# EAGLE design dherosh (EAGLE 9.2.2)
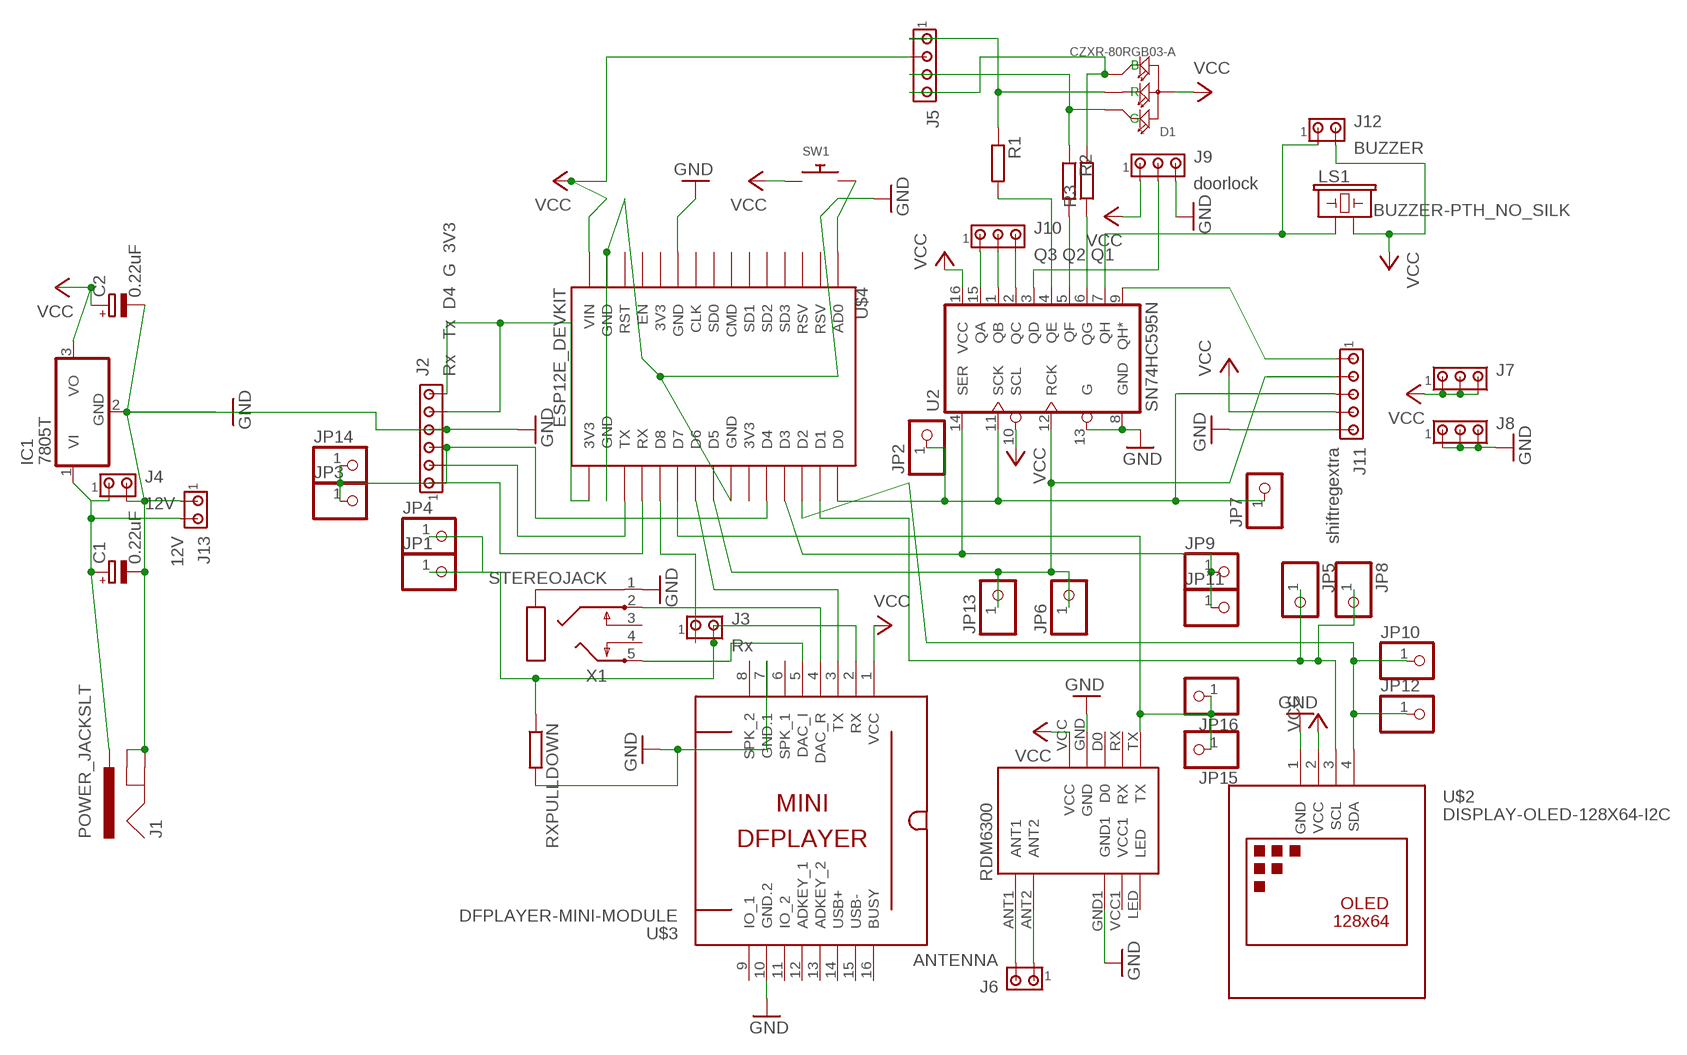
[diagram p0: schematic, sheet 1]

## Parts
C1  0.22uF  CPOL-EUE2-5  [E2-5]
C2  0.22uF  CPOL-EUE2-5  [E2-5]
D1  CZXR-80RGB03-A  DIP-LED-RGB-COMMON-ANODE(4P-D8MM)  [LED4-2.0-D8.0MM]
IC1  7805T  [TO220H]
J1  POWER_JACKSLT  [POWER_JACK_SLOT]
J2  Rx Tx D4 G 3V3  MTA06-100  [10X06MTA]
J3  Rx  MTA02-100  [10X02MTA]
J4  12V  MTA02-100  [10X02MTA]
J5  MTA04-100  [10X04MTA]
J6  ANTENNA  MTA02-100  [10X02MTA]
J7  MTA03-100  [10X03MTA]
J8  MTA03-100  [10X03MTA]
J9  doorlock  MTA03-100  [10X03MTA]
J10  Q3 Q2 Q1  MTA03-100  [10X03MTA]
J11  shiftregextra  MTA05-100  [10X05MTA]
J12  BUZZER  MTA02-100  [10X02MTA]
J13  12V  MTA02-100  [10X02MTA]
JP1  PINHD-1X1  [1X01]
JP2  PINHD-1X1  [1X01]
JP3  PINHD-1X1  [1X01]
JP4  PINHD-1X1  [1X01]
JP5  PINHD-1X1  [1X01]
JP6  PINHD-1X1  [1X01]
JP7  PINHD-1X1  [1X01]
JP8  PINHD-1X1  [1X01]
JP9  PINHD-1X1  [1X01]
JP10  PINHD-1X1  [1X01]
JP11  PINHD-1X1  [1X01]
JP12  PINHD-1X1  [1X01]
JP13  PINHD-1X1  [1X01]
JP14  PINHD-1X1  [1X01]
JP15  PINHD-1X1  [1X01]
JP16  PINHD-1X1  [1X01]
LS1  BUZZER-PTH_NO_SILK  [BUZZER-12MM-NS]
R1  R-EU_0204/7  [0204/7]
R2  R-EU_0204/7  [0204/7]
R3  R-EU_0204/7  [0204/7]
RDM1  RDM6300  [RDM6300]
RXPULLDOWN  R-EU_0204/7  [0204/7]
SW1  SWITCH_PUSHBUTTONEVQ-PE  [TACT_PANA-EVQ]
U2  SN74HC595N  74HC595N  [DIP16]
U$2  DISPLAY-OLED-128X64-I2C  [DISPLAY-OLED-128X64-I2C]
U$3  DFPLAYER-MINI-MODULE  [DFPLAYER-MINI-MODULE]
U$4  ESP12E_DEVKIT  [ESP12E_DEVKIT]
X1  STEREOJACK  [STX3100]

## Nets
GND: C1.- C2.- IC1.2(GND) J1.GND@1(GNDBREAK) J1.GND@2(GND) J2.4 J4.2 J8.1 J8.2 J8.3 J9.3 J11.5 J13.1 RDM1.GND RDM1.GND1 RXPULLDOWN.2 U2.8(GND) U2.13(G) U$2.1(GND) U$3.7(GND.1) U$3.10(GND.2) U$4.GND@0(GND) U$4.GND@1(GND) U$4.GND@2(GND) U$4.GND@3(GND) X1.1
N$1: C1.+ IC1.1(VI) J1.PWR J4.1 J13.2
N$2: J2.5 J2.6 U$4.3V3@2(3V3)
N$3: U$3.3(TX) U$4.D6
N$4: J2.3 JP3.1 JP14.1 U$4.D4
N$5: U$3.5(DAC_I) X1.5
N$6: U$3.4(DAC_R) X1.2
N$7: J11.3 JP2.1 JP7.1 U2.11(SCK) U$4.D0
N$8: J11.2 JP6.1 JP13.1 U2.12(RCK) U$4.D5
N$9: J3.2 JP1.1 JP4.1 RXPULLDOWN.1 U$3.2(RX)
N$10: JP15.1 JP16.1 RDM1.TX U$4.D7
N$11: JP5.1 JP8.1 U$2.3(SCL) U$4.D1
N$12: JP10.1 JP12.1 U$2.4(SDA) U$4.D2
N$13: J10.1 U2.15(QA)
N$14: D1.4(B) J5.4 R3.2
N$15: R3.1 U2.6(QG)
N$16: D1.1(R) J5.1 R1.1
N$17: R2.2 U2.5(QF)
N$19: SW1.P$2 U$4.AD0
N$20: J11.1 U2.9(QH*)
N$21: J12.1 LS1.+ U2.7(QH)
N$22: J10.2 U2.1(QB)
N$23: J10.3 U2.2(QC)
N$24: J2.1 U$4.RX
N$25: J9.2 U2.3(QD)
N$26: R1.2 U2.4(QE)
N$27: J2.2 U$4.TX
N$29: J6.2 RDM1.ANT1
N$30: J6.1 RDM1.ANT2
N$31: J3.1 U$4.D8
N$32: JP9.1 JP11.1 U2.14(SER) U$4.D3
N$34: D1.3(G) J5.3 R2.1
VCC: C2.+ D1.2(+) IC1.3(VO) J5.2 J7.1 J7.2 J7.3 J9.1 J11.4 J12.2 LS1.- RDM1.VCC SW1.P$1 U2.10(SCL) U2.16(VCC) U$2.2(VCC) U$3.1(VCC) U$4.VIN
Unconnected: RDM1.D0 RDM1.LED RDM1.RX RDM1.VCC1 U$3.6(SPK_1) U$3.8(SPK_2) U$3.9(IO_1) U$3.11(IO_2) U$3.12(ADKEY_1) U$3.13(ADKEY_2) U$3.14(USB+) U$3.15(USB-) U$3.16(BUSY) U$4.3V3@0(3V3) U$4.3V3@1(3V3) U$4.CLK U$4.CMD U$4.EN U$4.RST U$4.RSV@0(RSV) U$4.RSV@1(RSV) U$4.SD0 U$4.SD1 U$4.SD2 U$4.SD3 X1.3 X1.4

## Library data of the parts
C1 C2 = rcl:CPOL-EU: POLARIZED CAPACITOR, European symbol; SPICEPREFIX: C
D1 = OPL_Optoelectronics:DIP-LED-RGB-COMMON-ANODE(4P-D8MM): 304090065; MPN: CZXR-80RGB03-A
IC1 = adafruit:78*: Positive VOLTAGE REGULATOR Added bigger pads to the TO-92 package
J1 = SparkFun-Connectors:POWER_JACK: Power Jack Connector This is the standard 5.5mm barrel jack for power. The PTH is the most common, proven, reliable, footprint. The Slot footprint only works if the mill layer is transmitted to the PCB fab house so be warned. Here are the connectors we sell at SparkFun: DC Barrel Power Jack/Connector <https://www.sparkfun.com/products/119> (PRT-00119) DC Barrel Power Jack/Connector (SMD) <https://www.sparkfun.com/products/12748> (PRT-12748) DC Barrel Jack Adapter - Breadboard Compatible <https://www.sparkfun.com/products/10811> (PRT-10811) It is used on this SparkFun product (and many, many others): SparkFun RedBoard - Programmed with Arduino <https://www.sparkfun.com/products/12757> (DEV-12757) Also, if you need a mating power supply or connector, please check these out: Wall Adapter Power Supply - 9VDC 650mA <https://www.sparkfun.com/products/298> (TOL-00298) DC Barrel Jack Adapter - Male <https://www.sparkfun.com/products/10287> (PRT-10287); PROD_ID: PRT-00119
J2 = con-amp:MTA06-100: AMP connector Connection corrected 2014-09-19
J3 J4 J6 J12 J13 = con-amp:MTA02-100: AMP connector
J5 = con-amp:MTA04-100: AMP connector
J7-J10 = con-amp:MTA03-100: AMP connector
J11 = con-amp:MTA05-100: AMP connector
JP1-JP16 = pinhead:PINHD-1X1: PIN HEADER
LS1 = SparkFun-Electromechanical:BUZZER: Buzzer Small round buzzers that operate around the audible 2kHz range. You can use these as speakers to create simple music or user interfaces. Variant Overview: PTH - Mini Speaker - PC Mount 12mm 2.048kHz <https://www.sparkfun.com/products/7950> PTH_KIT - Mini Speaker - PC Mount 12mm 2.048kHz <https://www.sparkfun.com/products/7950> KIT simplifies soldering by adding stop mask to one side of the pads. PTH_NO_SILK - Mini Speaker - PC Mount 12mm 2.048kHz <https://www.sparkfun.com/products/7950> No silkscreen indicator of buzzer outline. PTH_KIT_NO_SILK - Mini Speaker - PC Mount 12mm 2.048kHz <https://www.sparkfun.com/products/7950> KIT package w/o silkscreen SMD - Buzzer Audio Magnetic (CCV-084B16) SMD buzzer used on, e.g. the LilyPad Buzzer <https://www.sparkfun.com/products/8463> and RFID USB Reader <https://www.sparkfun.com/products/9963>. SMD_KIT - Buzzer Audio Magnetic (CCV-084B16) SMD Buzzer with elongated pins to make soldering easier. Used on the SparkFun Simon Says - Surface Mount Soldering Kit <https://www.sparkfun.com/products/10935>.; PROD_ID: COMP-08253; SF_SKU: COM-07950
R1-R3 RXPULLDOWN = rcl:R-EU_: RESISTOR, European symbol; SPICEPREFIX: R
RDM1 = rdm6300:RDM6300: 125kHz RFID Reader Module
SW1 = adafruit:SWITCH_PUSHBUTTON: Buttons SOFTTOUCHSMD_SJ - Soft touch temporary push button (Super Junk Akihabara) Compatible with SKPMANE010 [Mouser: 688-SKPMAN] C&K_KSS = Digikey: KSS221GLFS
U2 = SparkFun-IC-Logic:74*595: 8-Bit Shift Register (Serial to Parallel) Datasheet <http://cdn.sparkfun.com/datasheets/BreakoutBoards/MM74HC595.pdf> SparkFun Products SparkFun Shift Register Breakout - 74HC595 <https://www.sparkfun.com/products/10680> (BOB-10680); PROD_ID: IC-13123
U$2 = diy-modules:DISPLAY-OLED-128X64-I2C: 128x64 Dot Matrix OLED Module based on SSD1306 chip Variant with I2C interface More details available here: http://www.instructables.com/id/Monochrome-096-i2c-OLED-display-with-arduino-SSD13/ SSD1306 datasheet: https://cdn-shop.adafruit.com/datasheets/SSD1306.pdf Click here to find device on ebay.com <http://www.ebay.com/sch/oled+display+128x64+iic> Note: There are two variants: I2C and SPI. Search for the proper version.
U$3 = diy-modules:DFPLAYER-MINI-MODULE: DFPlayer Mini - MP3 player module based on YX5200 chip More details available here: https://www.dfrobot.com/wiki/index.php/DFPlayer_Mini_SKU:DFR0299 Click here to find device on ebay.com <http://www.ebay.com/sch/dfplayer+mini>
U$4 = ESP12E_DEVKIT:ESP12E_DEVKIT: ESP12E DEVKIT BOARD
X1 = adafruit:STEREOJACK: MIC/HEADPHONE JACK Stereo jack with two switches. Kycon STX3100, CUI SJ1-3555NG and/or 4UCon 05544

## Board
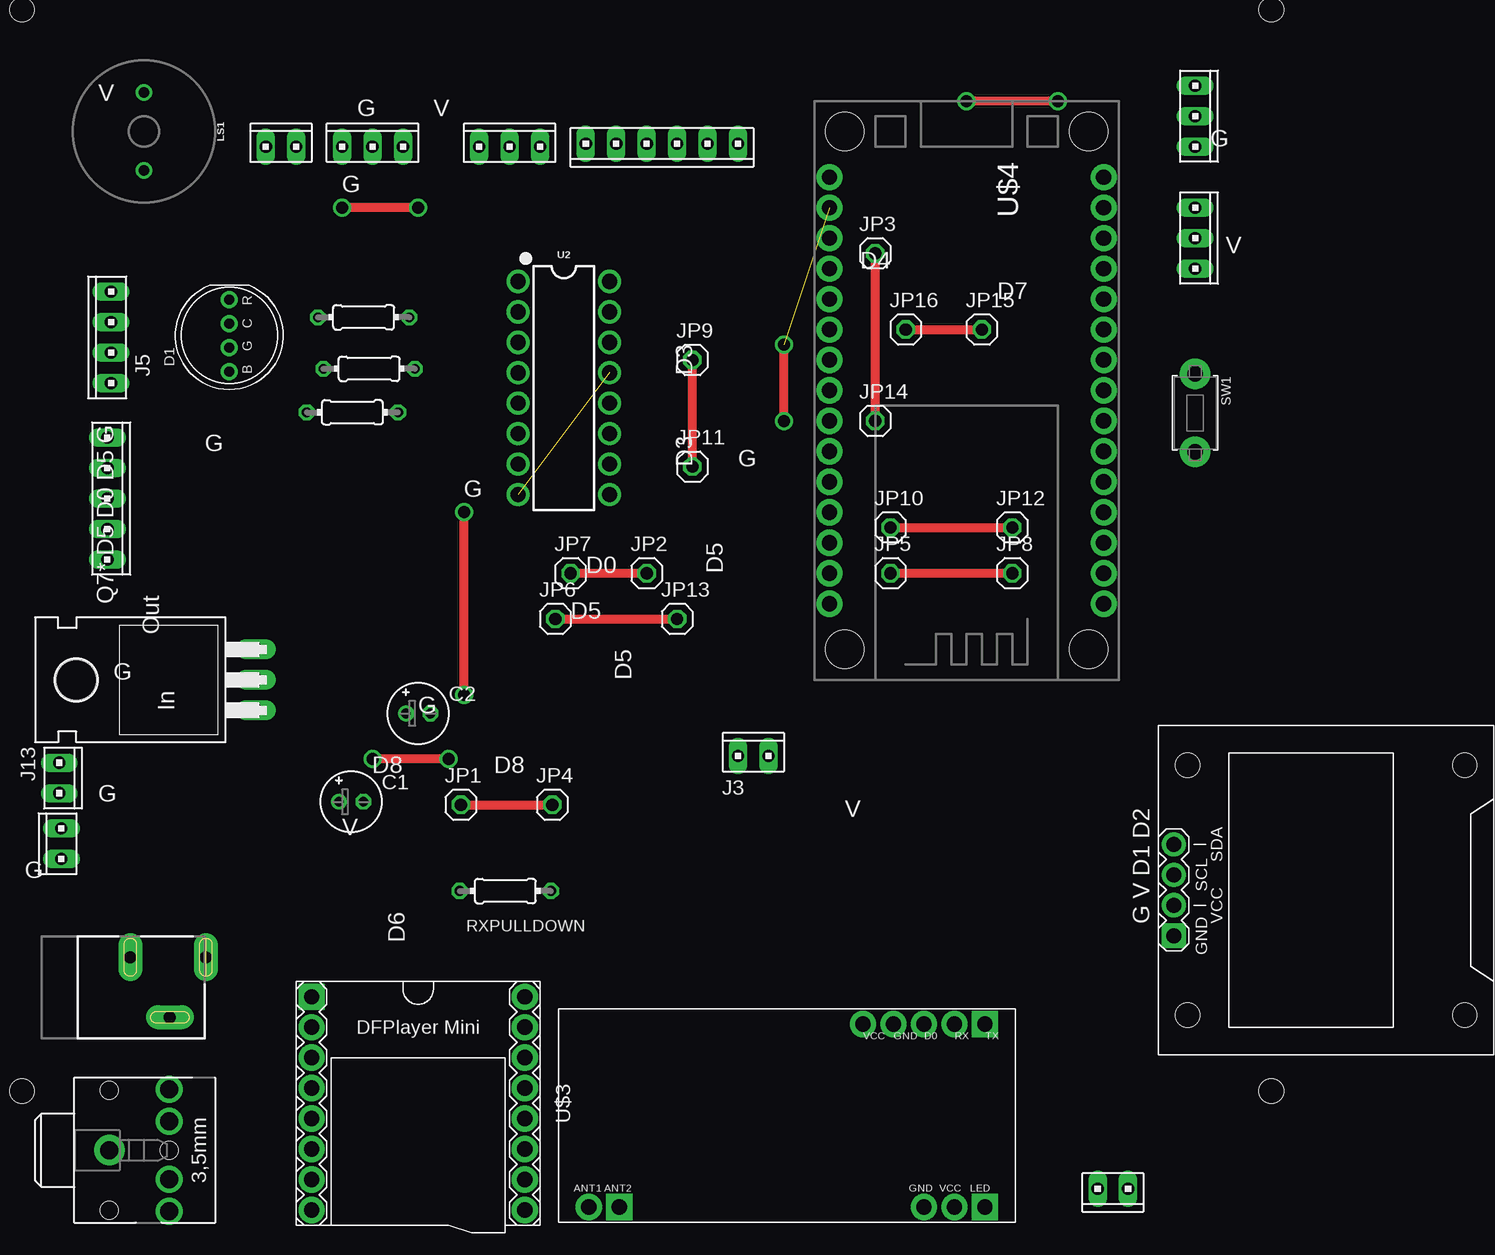
[diagram p1: board, top side]
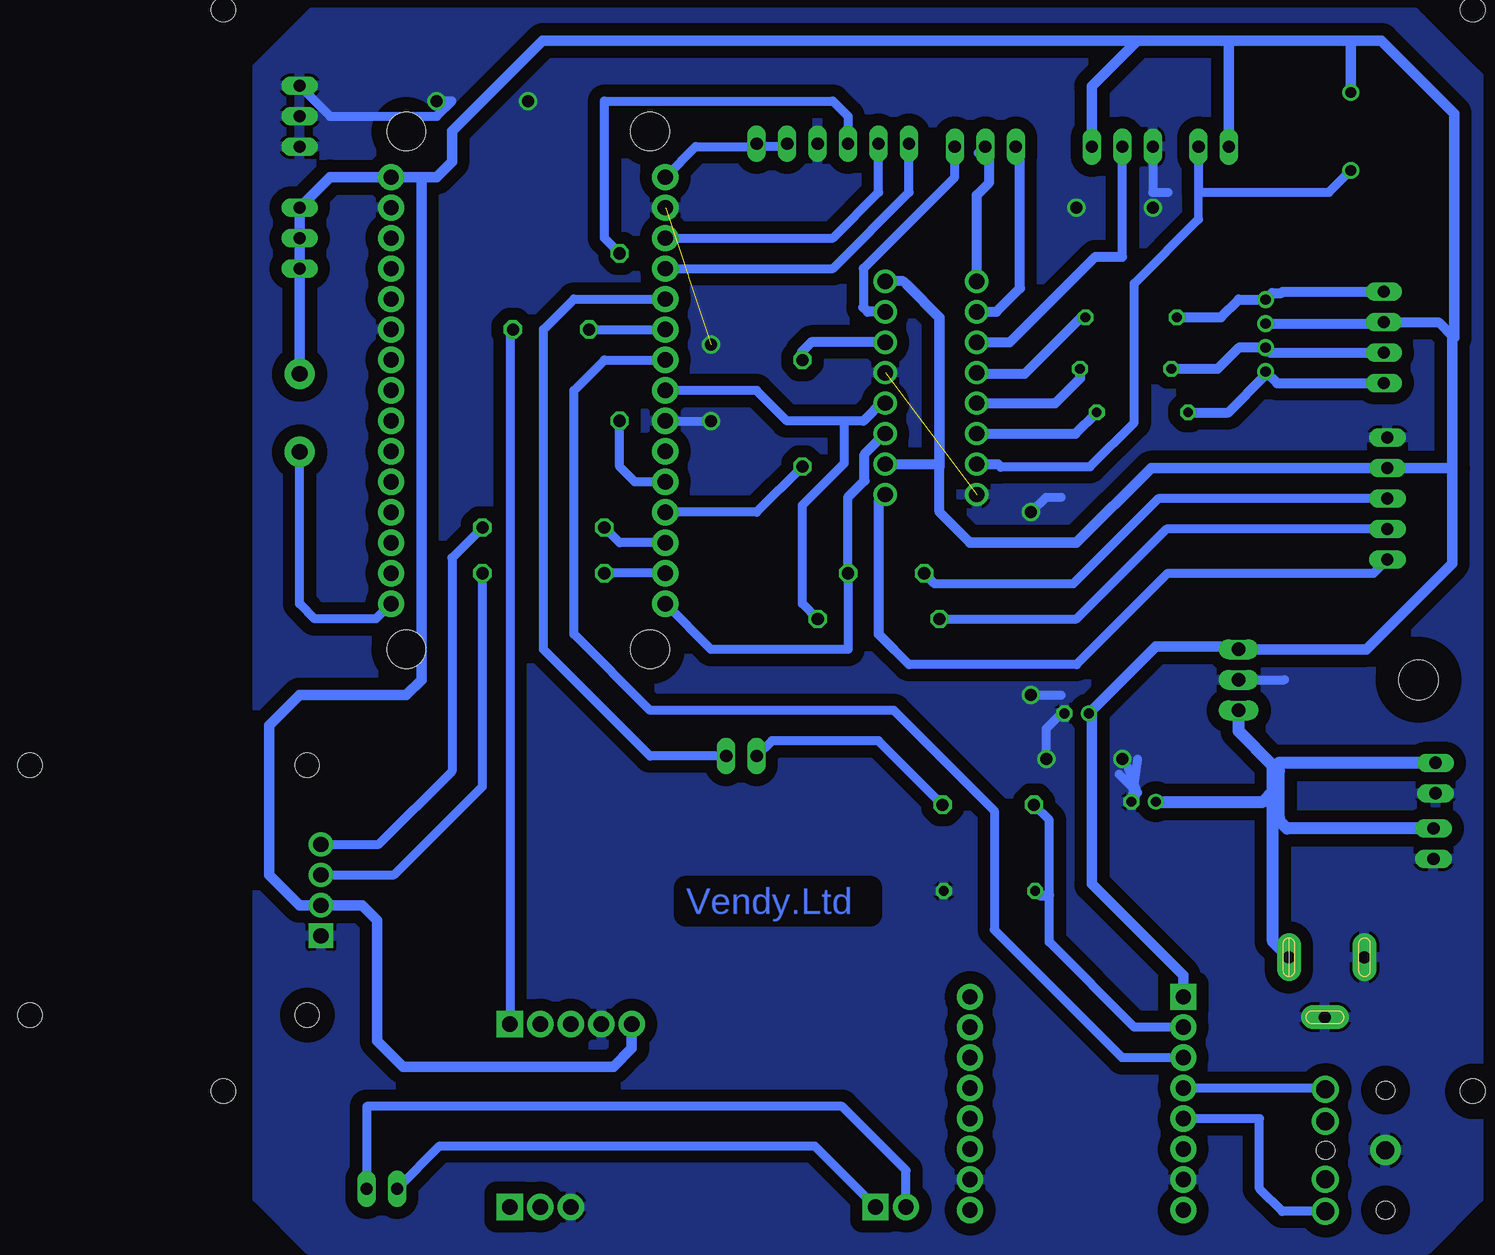
[diagram p2: board, bottom side, seen from below]

No outline drawn. Coordinates in mm, seen from the top.
Copper layers (1*16): Top 0.035mm / dielectric 1.5mm / Bottom 0.035mm
Design rules "default *": minimum track width 10mil, minimum drill 0.6mm, track to track 8mil, track to pad 8mil, pad to pad 8mil, via to via 8mil, smd to smd 6mil, copper to edge 50mil, drill to drill 10mil, minimum pad ring 10mil, minimum via ring 8mil, stop-mask expansion 4mil, vias tented up to drill 0mil, thermal gap 10mil
Holes 2.03 mm at -7.62,129.54 96.52,129.54 -7.62,39.37 96.52,39.37

### Footprints (pad centres in the part's own frame; a part is rotated, then mirrored left to right if it is on the bottom)
E2-5 = drill 0.813 pad 1.27: + -1.016,0 | drill 0.813 pad 1.27 octagon: - 1.016,0
LED4-2.0-D8.0MM = drill 0.85 pad 1.4: 1 3,0; 2 1,0; 3 -1,0; 4 -3,0
TO220H = drill 1.118 long: 1 -2.54,-10.16; 2 0,-10.16; 3 2.54,-10.16 | hole 3.302: 0,4.826
POWER_JACK_SLOT = drill 1 pad 2 long: GND@1 2.58,7.5; GND@2 7.58,10.8; PWR 2.58,13.8
10X06MTA = drill 1.016 long: 1 6.35,0; 2 3.81,0; 3 1.27,0; 4 -1.27,0; 5 -3.81,0; 6 -6.35,0
10X02MTA = drill 1.016 long: 1 1.27,0; 2 -1.27,0
10X04MTA = drill 1.016 long: 1 3.81,0; 2 1.27,0; 3 -1.27,0; 4 -3.81,0
10X03MTA = drill 1.016 long: 1 2.54,0; 2 0,0; 3 -2.54,0
10X05MTA = drill 1.016 long: 1 5.08,0; 2 2.54,0; 3 0,0; 4 -2.54,0; 5 -5.08,0
1X01 = drill 1.016 octagon: 1 0,0
BUZZER-12MM-NS = drill 0.9: + 3.25,0; - -3.25,0
0204/7 = drill 0.813 octagon: 1 -3.81,0; 2 3.81,0
RDM6300 = drill 1.27 pad 2.184: ANT1 -16.51,-7.62; D0 11.43,7.62; GND 8.89,7.62; GND1 11.43,-7.62; RX 13.97,7.62; VCC 6.35,7.62; VCC1 13.97,-7.62 | drill 1.27 pad 2.184 square: ANT2 -13.97,-7.62; LED 16.51,-7.62; TX 16.51,7.62
TACT_PANA-EVQ = drill 1.3 pad 2.54: P$1 -3.25,0; P$2 3.25,0
DIP16 = drill 1.27 pad 1.93: 1 -8.89,-3.81; 2 -6.35,-3.81; 3 -3.81,-3.81; 4 -1.27,-3.81; 5 1.27,-3.81; 6 3.81,-3.81; 7 6.35,-3.81; 8 8.89,-3.81; 9 8.89,3.81; 10 6.35,3.81; 11 3.81,3.81; 12 1.27,3.81; 13 -1.27,3.81; 14 -3.81,3.81; 15 -6.35,3.81; 16 -8.89,3.81
DISPLAY-OLED-128X64-I2C = drill 1.27 pad 2.032 square: 1 -3.81,12.7 | drill 1.27 pad 2.032: 2 -1.27,12.7; 3 1.27,12.7; 4 3.81,12.7 | hole 2: -10.414,11.557; 10.414,11.557; 10.414,-11.557; -10.414,-11.557
DFPLAYER-MINI-MODULE = drill 1.27 pad 2.184 square: 1 -8.89,-8.89 | drill 1.27 pad 2.184: 2 -6.35,-8.89; 3 -3.81,-8.89; 4 -1.27,-8.89; 5 1.27,-8.89; 6 3.81,-8.89; 7 6.35,-8.89; 8 8.89,-8.89; 9 8.89,8.89; 10 6.35,8.89; 11 3.81,8.89; 12 1.27,8.89; 13 -1.27,8.89; 14 -3.81,8.89; 15 -6.35,8.89; 16 -8.89,8.89
ESP12E_DEVKIT = drill 1.27 pad 2.184: 3V3@0 -11.43,-7.62; 3V3@1 11.43,5.08; 3V3@2 11.43,-17.78; AD0 -11.43,17.78; CLK -11.43,-2.54; CMD -11.43,2.54; D0 11.43,17.78; D1 11.43,15.24; D2 11.43,12.7; D3 11.43,10.16; D4 11.43,7.62; D5 11.43,0; D6 11.43,-2.54; D7 11.43,-5.08; D8 11.43,-7.62; EN -11.43,-10.16; GND@0 -11.43,-5.08; GND@1 -11.43,-15.24; GND@2 11.43,2.54; GND@3 11.43,-15.24; RST -11.43,-12.7; RSV@0 -11.43,15.24; RSV@1 -11.43,12.7; RX 11.43,-10.16; SD0 -11.43,0; SD1 -11.43,5.08; SD2 -11.43,7.62; SD3 -11.43,10.16; TX 11.43,-12.7; VIN -11.43,-17.78 | hole 3.2: -10.16,21.59; 10.16,21.59; 10.16,-21.59; -10.16,-21.59
STX3100 = drill 1.5 pad 2.54: 1 2.7,-0.1 | drill 1.5: 2 7.7,5; 3 7.7,2.3; 4 7.7,-2.5; 5 7.7,-5.2 | hole 1.5: 2.7,4.9; 2.7,-5.1; 7.7,-0.1

### Placement (x,y rotation side)
C1  19.81,63.5 0 top
C2  25.4,70.87 0 top
D1  9.65,102.36 90 top
IC1  1.73,73.66 90 top
J1  -6.1,53.11 270 top
J2  45.72,118.36 180 top
J3  53.34,67.31 0 top
J4  -4.34,59.99 90 top
J5  -0.2,102.21 90 top
J6  83.31,31.24 180 top
J7  90.17,110.49 270 top
J8  90.17,120.65 270 top
J9  21.59,118.11 0 top
J10  33.02,118.11 0 top
J11  -0.51,88.77 270 top
J12  13.97,118.11 0 top
J13  -4.52,65.48 270 top
JP1  28.96,63.25 0 top
JP2  44.45,82.55 0 top
JP3  63.5,109.22 0 top
JP4  36.58,63.25 0 top
JP5  64.77,82.55 0 top
JP6  36.83,78.74 0 top
JP7  38.1,82.55 0 top
JP8  74.93,82.55 0 top
JP9  48.26,100.33 0 top
JP10  64.77,86.36 0 top
JP11  48.26,91.44 0 top
JP12  74.93,86.36 0 top
JP13  46.99,78.74 0 top
JP14  63.5,95.25 0 top
JP15  72.39,102.87 0 top
JP16  66.04,102.87 0 top
LS1  2.54,119.38 270 top
R1  20.85,103.89 0 top
R2  21.31,99.59 0 top
R3  19.91,95.96 180 top
RDM1  56.13,37.34 0 top
RXPULLDOWN  32.66,56.06 0 top
SW1  90.17,95.91 270 top
U2  37.54,97.99 270 top
U$2  101.09,56.13 90 top
U$3  25.4,38.35 270 top
U$4  71.12,97.79 180 top
X1  -3.05,34.54 0 top

### Tracks (layer width: path | path; a pad name or v marks a point on that pad's centre or on a via)
GND  (via drill 1)  (2 unrouted)
  Top 0.762: v29.21,72.39 v29.21,87.63 | v27.94,67.06 v21.59,67.06 | v55.88,95.25 v55.88,101.6 | v78.74,121.92 v71.12,121.92 | v25.4,113.03 v19.05,113.03
  Bottom 0.762: 21.84,65.79 20.32,64.26 | 20.32,67.06 C1.- 20.32,64.26 | J9.3 19.05,114.3 17.78,114.3 | v29.21,72.39 26.67,72.39 | v21.59,67.06 21.34,66.8 20.32,64.26 | U$4.GND@2 v55.88,95.25 | v29.21,87.63 27.94,88.9 26.67,88.9 | J8.3 87.63,120.65 78.74,120.65 77.47,121.92 v78.74,121.92 | IC1.2 8.08,73.66 | v27.94,67.06 27.94,69.6 26.67,70.87 C2.-
  pour Bottom (isolate 1.016): -7.87,124.21 -3.3,128.78 -2.79,129.29 -2.29,129.29 89.15,129.29 93.73,124.71 93.73,124.46 93.73,30.48 89.41,26.16 -3.81,26.16 -8.13,30.48 -8.13,123.95
N$1
  Bottom 0.762: -4.27,61.19 J4.1
  Bottom 1.016: J13.2 8.53,66.75 8.53,66.04 | IC1.1 11.89,69.39 9.03,66.53 | 8.53,66.04 9.03,66.53 | J4.1 7.87,61.27 8.66,62.05 8.53,62.18 8.53,66.04 | J1.PWR 9.03,51.86 9.03,64.31 | 9.03,64.31 9.03,66.53 | C1.+ 9.84,63.5 9.03,64.31
N$2
  Bottom 0.762: 52.07,118.11 J2.6 | J2.5 49.78,118.11 52.07,118.11 | U$4.3V3@2 57.15,118.11 52.07,118.11
N$3
  Bottom 0.762: U$3.3 21.59,42.16 32.26,52.83 32.26,62.74 40.64,71.12 60.96,71.12 67.31,77.47 67.31,97.79 64.77,100.33 U$4.D6
N$4
  Top 0.762: JP14.1 JP3.1
  Bottom 0.61: J2.3 44.45,119.63
  Bottom 0.762: J2.3 44.45,120.65 45.72,121.92 64.77,121.92 64.77,110.49 JP3.1 | U$4.D4 62.23,90.17 63.5,91.44 JP14.1
N$5
  Bottom 0.762: X1.5 8.26,29.34 10.16,31.24 10.16,37.08 U$3.5
N$6
  Bottom 0.762: X1.2 4.65,39.62 U$3.4
N$7
  Top 0.762: JP7.1 JP2.1
  Bottom 0.762: U$4.D0 55.88,76.2 44.45,76.2 JP2.1 44.45,88.9 | J11.3 18.59,88.77 25.68,81.69 37.24,81.69 JP7.1
  Bottom 0.813: 44.45,88.9 43.08,90.27 43.08,92.48 41.38,94.18 U2.11
N$8
  Top 0.762: JP6.1 JP13.1
  Bottom 0.762: 43.18,95.25 44.76,95.25 | 44.76,95.25 49.53,95.25 52.07,97.79 U$4.D5 | 44.76,95.25 44.76,91.72 48.26,88.21 48.26,80.01 JP13.1 | J11.2 17.91,86.23 25.4,78.74 JP6.1
  Bottom 0.813: U2.12 41.53,96.9 43.18,95.25
N$9
  Top 0.762: JP1.1 JP4.1
  Bottom 0.711: 17.78,44.7 U$3.2
  Bottom 0.762: J3.2 50.8,68.58 41.91,68.58 JP4.1 | U$3.2 20.57,44.7 27.69,51.82 27.69,55.7 27.69,61.98 JP1.1
  Bottom 0.813: RXPULLDOWN.1 28.5,55.7 27.69,55.7
N$10
  Top 0.762: JP16.1 JP15.1
  Bottom 0.762: JP15.1 72.64,102.62 RDM1.TX | JP16.1 U$4.D7
N$11
  Top 0.762: JP5.1 JP8.1
  Bottom 0.762: U$2.3 82.3,57.4 74.93,64.77 JP8.1 | U$4.D1 JP5.1
N$12
  Top 0.762: JP10.1 JP12.1
  Bottom 0.762: U$2.4 83.57,59.94 77.47,66.04 77.47,83.82 JP12.1 | U$4.D2 63.5,85.09 JP10.1
N$13
  Bottom 0.762: 43.18,104.72 43.18,107.95 35.56,115.57 J10.1
  Bottom 0.813: U2.15 42.8,104.34 43.18,104.72
N$14
  Bottom 0.813: R3.2 12.75,95.96 9.65,99.06 D1.4 8.69,98.4 J5.4
N$15
  Bottom 0.813: U2.6 25.5,94.18 R3.1
N$16
  Bottom 0.813: J5.1 8.23,106.02 8.33,105.92 9.09,105.92 D1.1 11.88,105.36 13.36,103.89 R1.1
N$17
  Bottom 0.813: U2.5 27.18,96.72 25.12,98.78 R2.2
N$19
  Bottom 0.762: SW1.P$2 90.17,80.01 88.9,78.74 83.82,78.74 U$4.AD0
N$20
  Bottom 0.762: J11.1 0.64,82.55 17.78,82.55 25.4,74.93 39.37,74.93 40.64,76.2
  Bottom 0.813: 40.64,76.2 41.91,77.47 41.91,88.54 U2.9
N$21
  Bottom 0.711: J12.1 15.24,112.06
  Bottom 0.762: 31.75,91.44 24.28,91.44 20.6,95.12 20.6,106.7 15.24,112.06 | LS1.+ 4.37,114.3 15.24,114.3 J12.1
  Bottom 0.813: U2.7 31.95,91.64 31.75,91.44
N$22
  Bottom 0.813: 33.88,106.73 U2.1 33.73,114.07 32.69,115.11 32.69,117.78 J10.2 33.55,117.58
N$23
  Bottom 0.813: U2.2 32.08,104.34 30.12,106.3 30.12,117.75 J10.3
N$24
  Bottom 0.762: J2.1 39.37,114.3 45.72,107.95 U$4.RX
N$25
  Bottom 0.762: 21.59,108.94 J9.2
  Bottom 0.813: U2.3 30.96,101.8 23.82,108.94 21.59,108.94
N$26
  Bottom 0.813: U2.4 33.66,99.19 29.72,99.19 25.02,103.89 R1.2
N$27
  Bottom 0.762: U$4.TX 45.72,110.49 41.91,114.3 J2.2
N$29
  Bottom 0.762: RDM1.ANT1 39.62,32.77 44.96,38.1 84.58,38.1 J6.2
N$30
  Bottom 0.762: RDM1.ANT2 47.24,34.8 78.49,34.8 J6.1
N$31
  Bottom 0.762: J3.1 60.96,67.31 69.85,76.2 69.85,102.87 67.31,105.41 U$4.D8
N$32
  Top 0.762: JP11.1 JP9.1
  Bottom 0.762: U$4.D3 52.07,87.63 JP11.1
  Bottom 0.813: U2.14 47.52,101.8 48.26,101.07 JP9.1
N$34
  Bottom 0.813: R2.1 13.64,99.59 11.84,101.4 9.69,101.4 D1.3 9.23,100.94 J5.3
VCC
  Bottom 0.61: 24.13,119.38 J9.1 | 88.9,114.3 J7.3
  Bottom 0.813: C2.+ 24.38,70.61 | D1.2 -0.09,103.36 J5.2 -4.78,103.48 -5.92,102.34 -6.07,102.18 | 34.29,85.09 36.83,87.63 36.83,91.44 36.83,91.64 U2.10 | 39.52,106.55 39.85,106.88 U2.16
  Bottom 0.889: 36.83,91.44 36.83,103.86 39.52,106.55 | -5.89,91.31 -5.89,83.36 1.27,76.2 IC1.3 12.14,76.45 18.8,76.45 C2.+ 24.13,70.61 24.13,56.64 16.51,49.02 U$3.1 | -5.92,102.34 -5.92,91.31 -5.89,91.31 | -6.07,102.18 -6.07,120.88 0,126.95 2.54,126.95 | 2.54,126.95 12.7,126.95 | 12.7,126.95 20.32,126.95 | 20.32,126.95 24.13,123.14 J9.1 | RDM1.VCC 62.48,42.93 64.01,41.4 81.53,41.4 83.69,43.56 83.69,53.59 84.96,54.86 U$2.2 90.17,54.86 92.71,57.4 92.71,69.85 90.17,72.39 81.28,72.39 80.01,73.66 80.01,115.57 | SW1.P$1 J7.1 J7.2 J7.3 87.63,115.57 U$4.VIN 80.01,115.57 | -5.89,91.31 J11.4 19.18,91.31 25.4,85.09 34.29,85.09 | J12.2 12.7,126.95 | LS1.- 2.54,126.95 | 20.32,126.95 69.9,126.95 77.47,119.38 77.47,116.84 78.74,115.57 80.01,115.57

### Text on the board
Bottom: Vendy.Ltd
tPlace: Out | In
tNames: V | G | V | G | G | V | D4 | D7 | D3 | G | D3 | G | G | D0 | D5 | Q7* D5 D0 D5 G | D5 | G | D5 | G | D8 | D8 | G | V | V | G | D6 | G V D1 D2